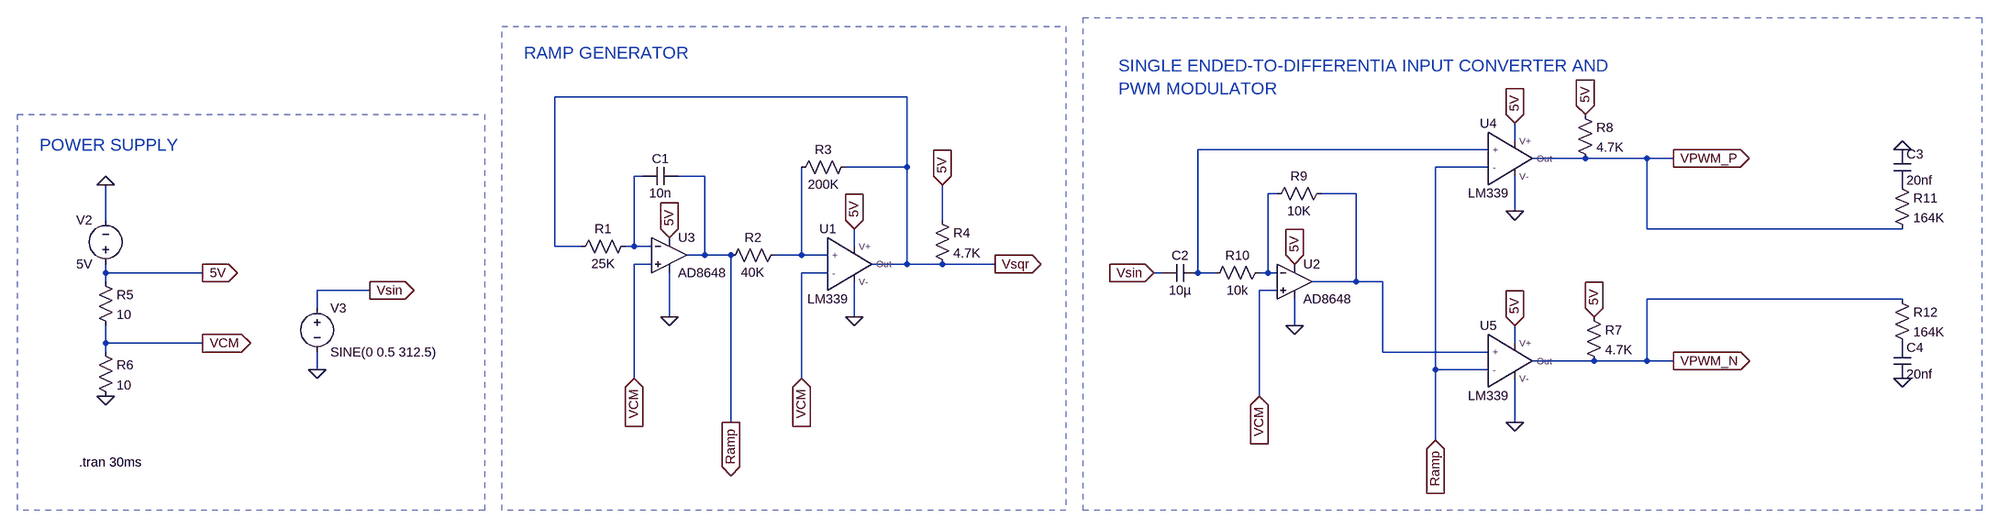
[diagram p0: schematic Analog1,2.asc]
Analog1,2.asc, the LTspice schematic file:
Version 4
SHEET 1 2408 1028
WIRE 272 -192 -368 -192
WIRE 1376 -112 1376 -144
WIRE 1328 -96 800 -96
WIRE 1504 -80 1408 -80
WIRE 1616 -80 1504 -80
WIRE 1664 -80 1616 -80
WIRE 272 -64 272 -192
WIRE 272 -64 160 -64
WIRE 1328 -64 1232 -64
WIRE -208 -48 -224 -48
WIRE -96 -48 -144 -48
WIRE 944 -16 928 -16
WIRE 1088 -16 1024 -16
WIRE 1376 16 1376 -48
WIRE -1184 32 -1184 -32
WIRE 336 32 336 -32
WIRE 1616 48 1616 -80
WIRE 2080 48 1616 48
WIRE -368 80 -368 -192
WIRE -320 80 -368 80
WIRE -224 80 -224 -48
WIRE -224 80 -240 80
WIRE -192 80 -224 80
WIRE 176 80 176 48
WIRE -96 96 -96 -48
WIRE -96 96 -128 96
WIRE -48 96 -96 96
WIRE 80 96 80 -64
WIRE 80 96 32 96
WIRE 128 96 80 96
WIRE -192 112 -224 112
WIRE 272 112 272 -64
WIRE 272 112 208 112
WIRE 336 112 272 112
WIRE 432 112 336 112
WIRE -1184 128 -1184 112
WIRE -1008 128 -1184 128
WIRE 128 128 80 128
WIRE 736 128 720 128
WIRE 800 128 800 -96
WIRE 832 128 800 128
WIRE 928 128 928 -16
WIRE 928 128 912 128
WIRE 944 128 928 128
WIRE -1184 144 -1184 128
WIRE 1088 144 1088 -16
WIRE 1088 144 1008 144
WIRE 1136 144 1088 144
WIRE -704 160 -800 160
WIRE 944 160 912 160
WIRE 2080 176 1616 176
WIRE -800 192 -800 160
WIRE -160 208 -160 128
WIRE 176 208 176 144
WIRE 976 224 976 176
WIRE -1184 256 -1184 224
WIRE -1008 256 -1184 256
WIRE 1376 256 1376 224
WIRE -1184 272 -1184 256
WIRE 1136 272 1136 144
WIRE 1328 272 1136 272
WIRE 1520 288 1408 288
WIRE 1616 288 1616 176
WIRE 1616 288 1520 288
WIRE 1664 288 1616 288
WIRE -800 304 -800 272
WIRE 1232 304 1232 -64
WIRE 1328 304 1232 304
WIRE -224 320 -224 112
WIRE 80 320 80 128
WIRE 912 352 912 160
WIRE -48 400 -48 96
WIRE 1376 400 1376 320
WIRE 1232 432 1232 304
FLAG -160 208 0
FLAG 176 208 0
FLAG -800 304 0
FLAG 1376 16 0
FLAG 976 224 0
FLAG 1664 -80 VPWM_P
IOPIN 1664 -80 Out
FLAG 1664 288 VPWM_N
IOPIN 1664 288 Out
FLAG -1184 352 0
FLAG -1184 -32 0
FLAG -1008 128 5V
IOPIN -1008 128 Out
FLAG -48 400 Ramp
IOPIN -48 400 Out
FLAG 1232 432 Ramp
IOPIN 1232 432 In
FLAG 432 112 Vsqr
IOPIN 432 112 Out
FLAG -1008 256 VCM
IOPIN -1008 256 Out
FLAG -224 320 VCM
IOPIN -224 320 In
FLAG 912 352 VCM
IOPIN 912 352 In
FLAG 80 320 VCM
IOPIN 80 320 In
FLAG -704 160 Vsin
IOPIN -704 160 Out
FLAG 720 128 Vsin
IOPIN 720 128 In
FLAG -160 64 5V
IOPIN -160 64 In
FLAG 336 -32 5V
IOPIN 336 -32 In
FLAG 976 112 5V
IOPIN 976 112 In
FLAG 1376 224 5V
IOPIN 1376 224 In
FLAG 1520 208 5V
IOPIN 1520 208 In
FLAG 1504 -160 5V
IOPIN 1504 -160 In
FLAG 1376 -144 5V
IOPIN 1376 -144 In
FLAG 176 48 5V
IOPIN 176 48 In
FLAG 1376 400 0
FLAG 2080 320 0
FLAG 2080 -96 0
DATAFLAG 976 -96 ""
SYMBOL LM339.New 160 112 R0
SYMATTR InstName U1
SYMBOL OpAmps\\AD8648 -160 32 R0
SYMATTR InstName U3
SYMBOL res 320 16 R0
SYMATTR InstName R4
SYMATTR Value 4.7K
SYMBOL res 176 -80 R90
WINDOW 0 0 56 VBottom 2
WINDOW 3 32 56 VTop 2
SYMATTR InstName R3
SYMATTR Value 200K
SYMBOL res 48 80 R90
WINDOW 0 0 56 VBottom 2
WINDOW 3 32 56 VTop 2
SYMATTR InstName R2
SYMATTR Value 40K
SYMBOL res -224 64 R90
WINDOW 0 0 56 VBottom 2
WINDOW 3 32 56 VTop 2
SYMATTR InstName R1
SYMATTR Value 25K
SYMBOL cap -144 -64 R90
WINDOW 0 0 32 VBottom 2
WINDOW 3 32 32 VTop 2
SYMATTR InstName C1
SYMATTR Value 10n
SYMBOL voltage -800 176 R0
WINDOW 123 0 0 Left 0
WINDOW 39 0 0 Left 0
SYMATTR InstName V3
SYMATTR Value SINE(0 0.5 312.5)
SYMBOL OpAmps\\AD8648 976 80 R0
SYMATTR InstName U2
SYMBOL LM339.New 1360 -80 R0
SYMATTR InstName U4
SYMBOL LM339.New 1360 288 R0
SYMATTR InstName U5
SYMBOL res 1504 192 R0
SYMATTR InstName R7
SYMATTR Value 4.7K
SYMBOL res 1488 -176 R0
SYMATTR InstName R8
SYMATTR Value 4.7K
SYMBOL res 1040 -32 R90
WINDOW 0 0 56 VBottom 2
WINDOW 3 32 56 VTop 2
SYMATTR InstName R9
SYMATTR Value 10K
SYMBOL res 928 112 R90
WINDOW 0 0 56 VBottom 2
WINDOW 3 32 56 VTop 2
SYMATTR InstName R10
SYMATTR Value 10k
SYMBOL cap 800 112 R90
WINDOW 0 0 32 VBottom 2
WINDOW 3 32 32 VTop 2
SYMATTR InstName C2
SYMATTR Value 10µ
SYMBOL voltage -1184 128 R180
WINDOW 0 24 96 Left 2
WINDOW 3 24 16 Left 2
WINDOW 123 0 0 Left 0
WINDOW 39 0 0 Left 0
SYMATTR InstName V2
SYMATTR Value 5V
SYMBOL res -1200 128 R0
SYMATTR InstName R5
SYMATTR Value 10
SYMBOL res -1200 256 R0
SYMATTR InstName R6
SYMATTR Value 10
SYMBOL res 2064 -48 R0
SYMATTR InstName R11
SYMATTR Value 164K
SYMBOL res 2064 160 R0
SYMATTR InstName R12
SYMATTR Value 164K
SYMBOL cap 2064 -96 R0
SYMATTR InstName C3
SYMATTR Value 20nf
SYMBOL cap 2064 256 R0
SYMATTR InstName C4
SYMATTR Value 20nf
TEXT -1232 472 Left 2 !.tran 30ms
TEXT -1304 -104 Left 3 ;POWER SUPPLY
TEXT 656 -248 Left 3 ;SINGLE ENDED-TO-DIFFERENTIA INPUT CONVERTER AND \nPWM MODULATOR
TEXT -424 -272 Left 3 ;RAMP GENERATOR
RECTANGLE Normal 560 560 -464 -320 2
RECTANGLE Normal -496 560 -1344 -160 2
RECTANGLE Normal 2224 560 592 -336 2

The netlist it stands for:
* Analog1,2.asc
XU1 N005 VCM 5V 0 Vsqr LM339  ; pins + - V+ V- Out
XU3 VCM N002 5V 0 Ramp AD8648  ; pins In+ In- V+ V- OUT
R4 5V Vsqr 4.7K
R3 Vsqr N005 200K
R2 N005 Ramp 40K
R1 N002 Vsqr 25K
C1 Ramp N002 10n
V3 Vsin 0 SINE(0 0.5 312.5)
XU2 VCM N003 5V 0 N004 AD8648  ; pins In+ In- V+ V- OUT
XU4 N001 Ramp 5V 0 VPWM_P LM339  ; pins + - V+ V- Out
XU5 N004 Ramp 5V 0 VPWM_N LM339  ; pins + - V+ V- Out
R7 5V VPWM_N 4.7K
R8 5V VPWM_P 4.7K
R9 N004 N003 10K
R10 N003 N001 10k
C2 N001 Vsin 10µ
V2 5V 0 5V
R5 5V VCM 10
R6 VCM 0 10
R11 P001 VPWM_P 164K
R12 VPWM_N P002 164K
C3 0 P001 20nf
C4 P002 0 20nf
.tran 30ms
* POWER SUPPLY
* SINGLE ENDED-TO-DIFFERENTIA INPUT CONVERTER AND
* PWM MODULATOR
* RAMP GENERATOR
.lib A:\Electronic LAB\LM339.new.sub
.lib ADI.lib
.backanno
.end